# EAGLE schematic step400_r1 (EAGLE 9.6.2)

## Sheet 1 of 3
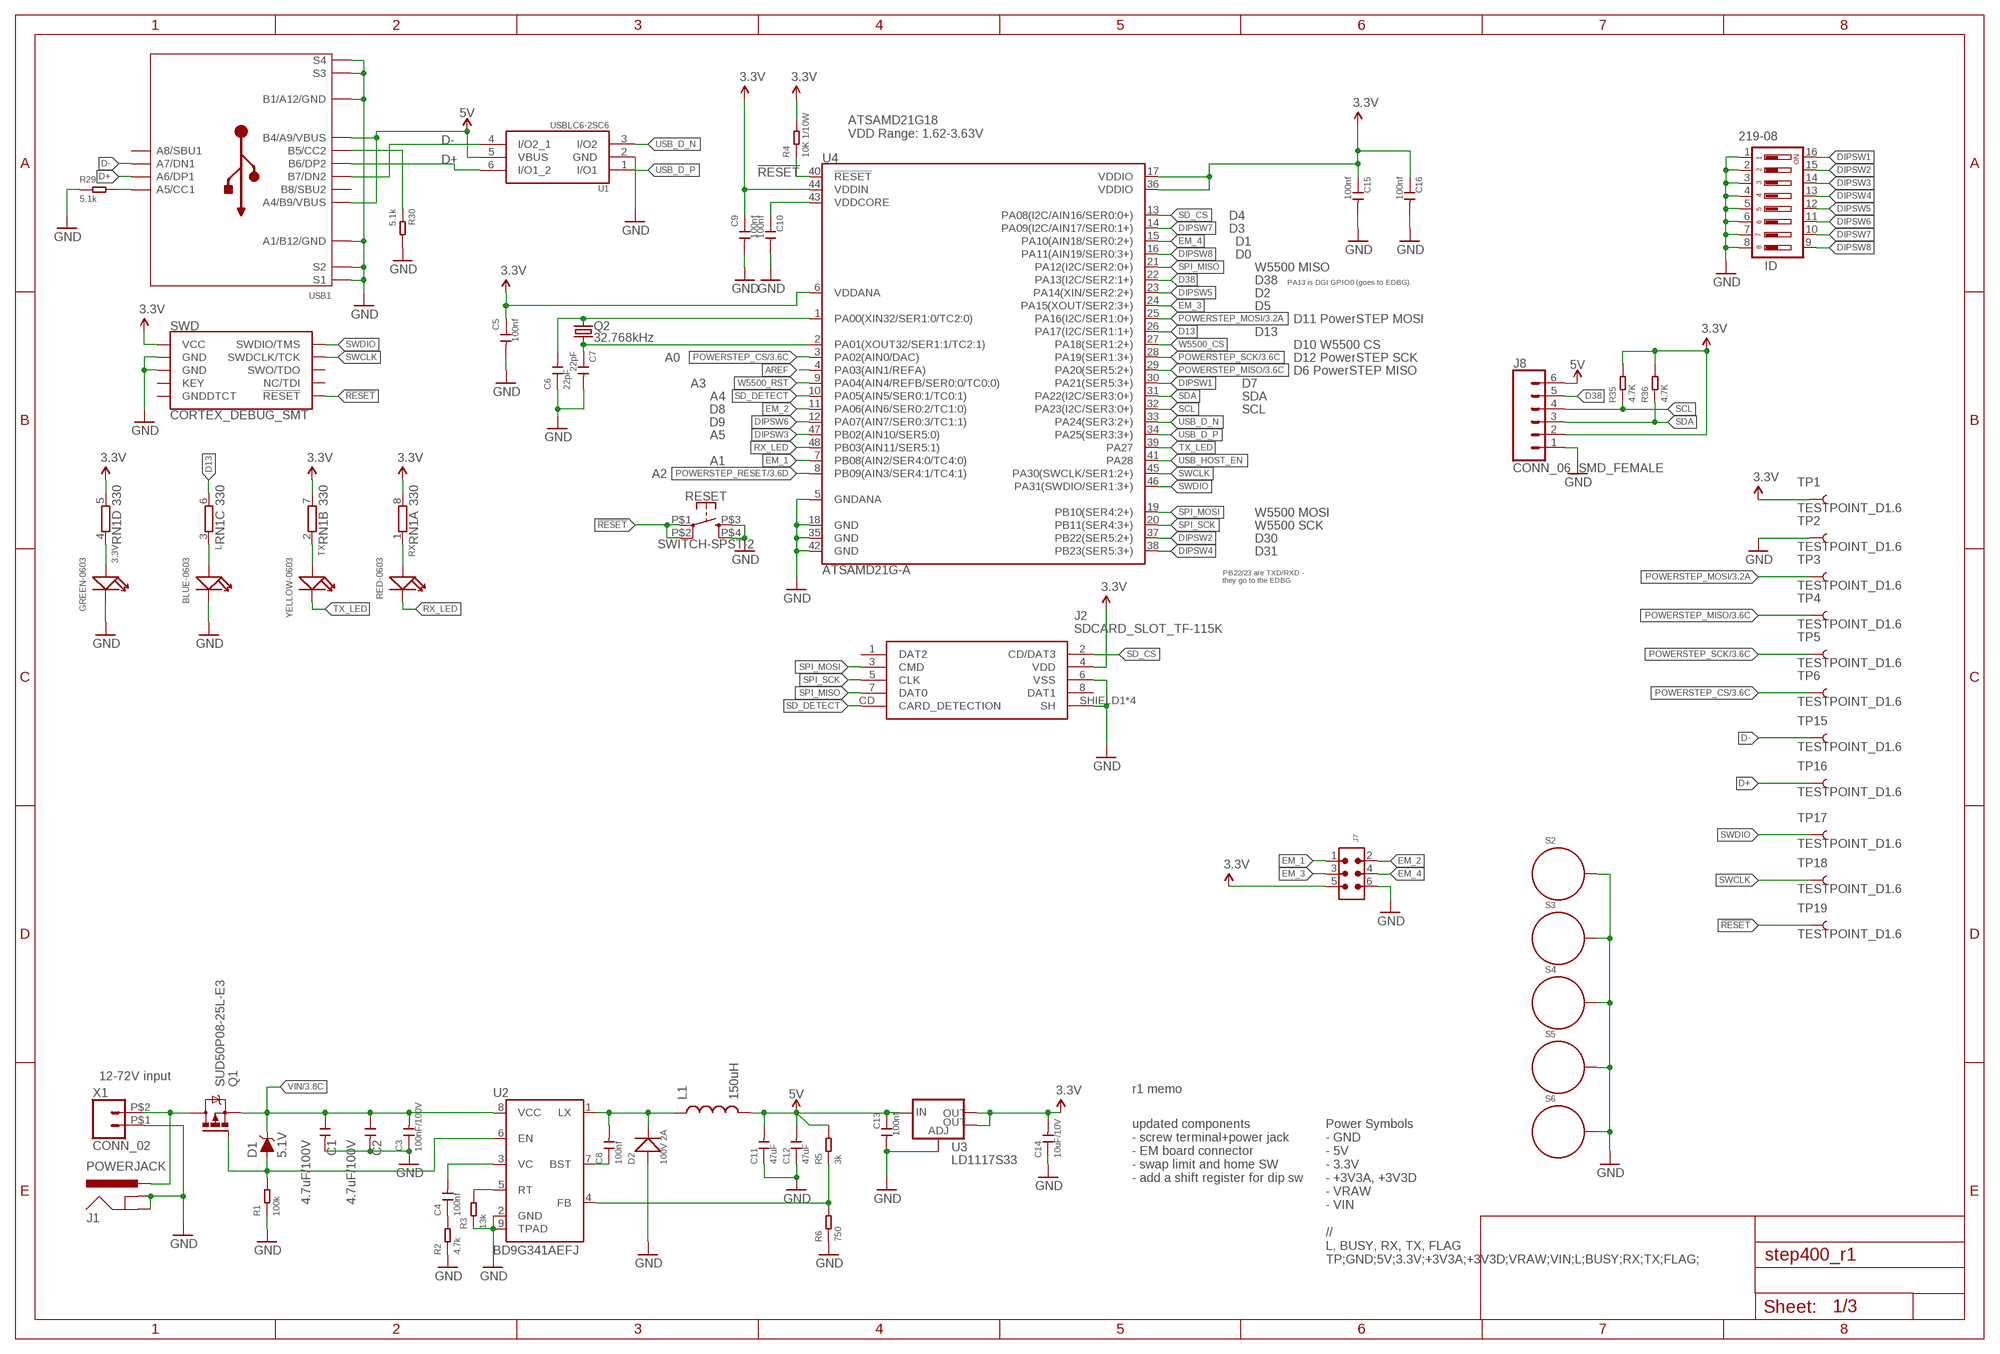
[diagram p0: schematic, sheet 1]

### Parts
3.3V  GREEN-0603  SMD-LED-CLEAR-GREEN(0603)  [LED-0603]
C1  4.7uF/100V  CERAMIC-10UF-16V-(-20%～+80%)-Y5V(1210)  [C1210]
C2  4.7uF/100V  CERAMIC-10UF-16V-(-20%～+80%)-Y5V(1210)  [C1210]
C3  100nF/100V  CERAMIC-100NF-50V-10%-X7R(0805)  [C0805]
C4  100nf  CERAMIC-100NF-50V-10%-X7R(0603)  [C0603]
C5  100nf  CERAMIC-100NF-25V-10%-X7R(0402)  [C0402]
C6  22pF  CERAMIC-15PF-50V-5%-NPO(0402)  [C0402]
C7  22pF  CERAMIC-15PF-50V-5%-NPO(0402)  [C0402]
C8  100nf  CERAMIC-100NF-50V-10%-X7R(0603)  [C0603]
C9  100nf  CERAMIC-100NF-25V-10%-X7R(0402)  [C0402]
C10  100nf  CERAMIC-100NF-25V-10%-X7R(0402)  [C0402]
C11  47uF  CERAMIC-100UF-6.3V-20%-X5R(1206)  [C1206]
C12  47uF  CERAMIC-100UF-6.3V-20%-X5R(1206)  [C1206]
C13  100nf  CERAMIC-100NF-25V-10%-X7R(0402)  [C0402]
C14  10uF/10V  CERAMIC-10UF-10V-(-20%～+80%)-Y5V(0805)  [C0805]
C15  100nf  CERAMIC-100NF-25V-10%-X7R(0402)  [C0402]
C16  100nf  CERAMIC-100NF-25V-10%-X7R(0402)  [C0402]
D1  5.1V  DIODE-ZENER-MM3Z3V3T1G  [SOD-323]
D2  100V 2A  SMD-DIODE-SCHOTTKY-40V-1A(DO-214AC)  [DO-214AC]
ID  219-08  [CTS-219-08]
J1  POWERJACK  [POWERJACK_SLOT]
J2  SDCARD_SLOT_TF-115K  [TF-115K]
J7  6120XX21621_61200621621  [61200621621]
J8  CONN_06_SMD_FEMALE  [1X06-SMD-FEMALE]
L  BLUE-0603  SMD-LED-CLEAR-BLUE(0603)  [LED-0603]
L1  150uH  L5045  [L5045_L]
Q1  SUD50P08-25L-E3  IRFR5305  [D-PAK_TO252AA]
Q2  32.768kHz  CRYSTALFC-135  [FC-135]
R1  100k  SMD-RES-100K-1%-1/10W(0603)  [R0603]
R2  4.7k  SMD-RES-100K-1%-1/10W(0603)  [R0603]
R3  13k  SMD-RES-100K-1%-1/10W(0603)  [R0603]
R4  10K 1/10W  SMD-RES-10K-5%-1/10W(0603)  [R0603]
R5  3k  SMD-RES-100K-1%-1/10W(0603)  [R0603]
R6  750  SMD-RES-100K-1%-1/10W(0603)  [R0603]
R29  5.1k  SMD-RES-5.1K-1%-1/10W(0603)  [R0603]
R30  5.1k  SMD-RES-5.1K-1%-1/10W(0603)  [R0603]
R35  4.7K  SMD-RES-4.7K-5%-1/10W(0603)  [R0603]
R36  4.7K  SMD-RES-4.7K-5%-1/10W(0603)  [R0603]
RESET  SWITCH-SPST-2  [SKRP]
RN1  330  4R-NCAY16_LONG_W  [CAY16_LONG_W]
RX  RED-0603  LED-SMD-RED-DIFFUSED(0603)  [LED-0603]
S2  STANDOFF_ELECTRICAL  [STANDOFF-ELECTRICAL]
S3  STANDOFF_ELECTRICAL  [STANDOFF-ELECTRICAL]
S4  STANDOFF_ELECTRICAL  [STANDOFF-ELECTRICAL]
S5  STANDOFF_ELECTRICAL  [STANDOFF-ELECTRICAL]
S6  STANDOFF_ELECTRICAL  [STANDOFF-ELECTRICAL]
SWD  CORTEX_DEBUG_SMT  [20021121-00010C4LF]
TP1  TESTPOINT_D1.6  [TESTPOINT_D1.6]
TP2  TESTPOINT_D1.6  [TESTPOINT_D1.6]
TP3  TESTPOINT_D1.6  [TESTPOINT_D1.6]
TP4  TESTPOINT_D1.6  [TESTPOINT_D1.6]
TP5  TESTPOINT_D1.6  [TESTPOINT_D1.6]
TP6  TESTPOINT_D1.6  [TESTPOINT_D1.6]
TP15  TESTPOINT_D1.6  [TESTPOINT_D1.6]
TP16  TESTPOINT_D1.6  [TESTPOINT_D1.6]
TP17  TESTPOINT_D1.6  [TESTPOINT_D1.6]
TP18  TESTPOINT_D1.6  [TESTPOINT_D1.6]
TP19  TESTPOINT_D1.6  [TESTPOINT_D1.6]
TX  YELLOW-0603  SMD-LED-CLEAR-YELLOW(0603)  [LED-0603]
U1  USBLC6-2SC6  [SOT23-6L]
U2  BD9G341AEFJ  [SOIC127P600X100-9N]
U3  LD1117S33  V_REG_LM1117SOT223  [SOT223]
U4  ATSAMD21G-A  [TQFP-48]
USB1  USB-C_USB2.0-TYPE-C  [USB-C_USB2.0-TYPE-C]
X1  CONN_02  [WJ25C-B-7.62-2P]

### Nets
3.3V [GND_]: C5.1 C9.1 C14.2 C15.1 C16.1 J2.4(VDD) J7.5 J8.2 R4.2 R35.2 R36.2 RN1.5 RN1.7 RN1.8 SWD.P$1(VCC) TP1.1 U3.2(OUT) U3.4(OUT) U4.6(VDDANA) U4.17(VDDIO) U4.36(VDDIO) U4.44(VDDIN) ; also sheet 2,3
5V: C11.2 C12.2 C13.1 J8.6 L1.P$2 R5.2 U1.5(VBUS) U3.3(IN) USB1.A4_B9(A4/B9/VBUS) USB1.B4_A9(B4/A9/VBUS) ; also sheet 3
!RESET: R4.1 RESET.P$1 RESET.P$2 SWD.P$10(!RESET) TP19.1 U4.40(!RESET!)
AREF: U4.4(PA03(AIN1/REFA))
D13: RN1.6 U4.26(PA17(I2C/SER1:1+))
D38: J8.5 U4.22(PA13(I2C/SER2:1+))
D+: TP16.1 U1.6(I/O1_2) USB1.A6(A6/DP1) USB1.B6(B6/DP2)
D-: TP15.1 U1.4(I/O2_1) USB1.A7(A7/DN1) USB1.B7(B7/DN2)
DIPSW1: ID.16 U4.30(PA21(SER5:3+))
DIPSW2: ID.15 U4.37(PB22(SER5:2+))
DIPSW3: ID.14 U4.47(PB02(AIN10/SER5:0))
DIPSW4: ID.13 U4.38(PB23(SER5:3+))
DIPSW5: ID.12 U4.23(PA14(XIN/SER2:2+))
DIPSW6: ID.11 U4.12(PA07(AIN7/SER0:3/TC1:1))
DIPSW7: ID.10 U4.14(PA09(I2C/AIN17/SER0:1+))
DIPSW8: ID.9 U4.16(PA11(AIN19/SER0:3+))
EM_1: J7.1 U4.7(PB08(AIN2/SER4:0/TC4:0))
EM_2: J7.2 U4.11(PA06(AIN6/SER0:2/TC1:0))
EM_3: J7.3 U4.24(PA15(XOUT/SER2:3+))
EM_4: J7.4 U4.15(PA10(AIN18/SER0:2+))
GND: 3.3V.- C1.2 C2.2 C3.1 C5.2 C6.1 C7.2 C9.2 C10.2 C11.1 C12.1 C13.2 C14.1 C15.2 C16.2 D2.1(+) ID.1 ID.2 ID.3 ID.4 ID.5 ID.6 ID.7 ID.8 J1.P$33(GNDBREAK) J1.P$34(GNDBREAK) J1.P$35(GNDBREAK) J1.P$36(GNDBREAK) J1.P$37(GNDBREAK) J1.P$38(GNDBREAK) J1.P$39(GNDBREAK) J1.P$40(GNDBREAK) J1.P$41(GNDBREAK) J1.P$42(GNDBREAK) J1.P$43(GNDBREAK) J1.P$44(GNDBREAK) J1.P$45(GNDBREAK) J1.P$46(GNDBREAK) J1.P$47(GNDBREAK) J1.P$48(GNDBREAK) J1.P$49(GNDBREAK) J1.P$50(GNDBREAK) J1.P$51(GNDBREAK) J1.P$52(GNDBREAK) J1.P$53(GNDBREAK) J1.P$54(GNDBREAK) J1.P$55(GNDBREAK) J1.P$56(GNDBREAK) J1.P$63(GND) J1.P$64(GND) J1.P$65(GND) J1.P$66(GND) J1.P$67(GND) J1.P$68(GND) J1.P$69(GND) J1.P$70(GND) J1.P$71(GND) J1.P$72(GND) J1.P$73(GND) J1.P$74(GND) J1.P$75(GND) J1.P$76(GND) J1.P$77(GND) J1.P$78(GND) J1.P$79(GND) J1.P$80(GND) J1.P$81(GND) J1.P$82(GND) J1.P$83(GND) J1.P$84(GND) J1.P$85(GND) J2.6(VSS) J2.SHIELD1(SH) J2.SHIELD2(SH) J2.SHIELD3(SH) J2.SHIELD4(SH) J7.6 J8.1 L.- R1.1 R2.1 R3.1 R6.1 R29.1 R30.2 RESET.P$3 RESET.P$4 S2.P1 S3.P1 S4.P1 S5.P1 S6.P1 SWD.P$3(GND) SWD.P$5(GND) TP2.1 U1.2(GND) U2.2(GND) U2.9(TPAD) U3.1(ADJ) U4.5(GNDANA) U4.18(GND) U4.35(GND) U4.42(GND) USB1.A1_B12(A1/B12/GND) USB1.B1_A12(B1/A12/GND) USB1.S7(S1) USB1.S8(S1) USB1.S9(S1) USB1.S10(S1) USB1.S11(S1) USB1.S12(S1) USB1.S13(S1) USB1.S14(S1) USB1.S15(S1) USB1.S16(S3) USB1.S17(S3) USB1.S18(S3) USB1.S19(S3) USB1.S20(S3) USB1.S21(S3) USB1.S22(S3) USB1.S23(S3) USB1.S24(S3) USB1.S25(S3) USB1.S26(S3) USB1.S27(S3) USB1.S29(S2) USB1.S30(S2) USB1.S31(S2) USB1.S32(S2) USB1.S33(S2) USB1.S34(S2) USB1.S35(S2) USB1.S36(S2) USB1.S37(S4) USB1.S38(S4) USB1.S39(S4) USB1.S40(S4) USB1.S41(S4) USB1.S42(S4) USB1.S43(S4) USB1.S44(S4) USB1.S45(S4) USB1.S46(S4) USB1.S47(S4) USB1.S48(S4) X1.P$1 ; also sheet 2,3
N$2: C6.2 Q2.P$2 U4.1(PA00(XIN32/SER1:0/TC2:0))
N$3: C4.1 R2.2
N$4: C7.1 Q2.P$1 U4.2(PA01(XOUT32/SER1:1/TC2:1))
N$5: RN1.1 RX.+
N$6: RN1.2 TX.+
N$7: R5.1 R6.2 U2.4(FB)
N$8: D1.A Q1.1(G) R1.2 U2.6(EN)
N$9: R3.2 U2.5(RT)
N$10: L.+ RN1.3
N$11: 3.3V.+ RN1.4
N$12: C4.2 U2.3(VC)
N$15: C8.1 U2.7(BST)
N$17: C8.2 D2.2(-) L1.P$1 U2.1(LX)
N$45: R30.1 USB1.B5(B5/CC2)
N$50: R29.2 USB1.A5(A5/CC1)
POWERSTEP_CS: TP6.1 U4.3(PA02(AIN0/DAC)) ; also sheet 3
POWERSTEP_MISO: TP4.1 U4.29(PA20(SER5:2+)) ; also sheet 3
POWERSTEP_MOSI: TP3.1 U4.25(PA16(I2C/SER1:0+)) ; also sheet 3
POWERSTEP_RESET: U4.8(PB09(AIN3/SER4:1/TC4:1)) ; also sheet 3
POWERSTEP_SCK: TP5.1 U4.28(PA19(SER1:3+)) ; also sheet 3
RX_LED: RX.- U4.48(PB03(AIN11/SER5:1))
SCL: J8.4 R35.1 U4.32(PA23(I2C/SER3:0+))
SD_CS: J2.2(CD/DAT3) U4.13(PA08(I2C/AIN16/SER0:0+))
SD_DETECT: J2.CD(CARD_DETECTION) U4.10(PA05(AIN5/SER0:1/TC0:1))
SDA: J8.3 R36.1 U4.31(PA22(I2C/SER3:0+))
SPI_MISO: J2.7(DAT0) U4.21(PA12(I2C/SER2:0+)) ; also sheet 2
SPI_MOSI: J2.3(CMD) U4.19(PB10(SER4:2+)) ; also sheet 2
SPI_SCK: J2.5(CLK) U4.20(PB11(SER4:3+)) ; also sheet 2
SWCLK: SWD.P$4(SWDCLK/TCK) TP18.1 U4.45(PA30(SWCLK/SER1:2+))
SWDIO: SWD.P$2(SWDIO/TMS) TP17.1 U4.46(PA31(SWDIO/SER1:3+))
TX_LED: TX.- U4.39(PA27)
USB_D_N: U1.3(I/O2) U4.33(PA24(SER3:2+))
USB_D_P: U1.1(I/O1) U4.34(PA25(SER3:3+))
USB_HOST_EN: U4.41(PA28)
VDDCORE: C10.1 U4.43(VDDCORE)
VIN: C1.1 C2.1 C3.2 D1.C Q1.3(S) U2.8(VCC) ; also sheet 3
VRAW: J1.P$2(PWR) J1.P$3(PWR) J1.P$4(PWR) J1.P$5(PWR) J1.P$6(PWR) J1.P$7(PWR) J1.P$8(PWR) J1.P$9(PWR) J1.P$10(PWR) J1.P$11(PWR) J1.P$12(PWR) J1.P$13(PWR) J1.P$14(PWR) J1.P$15(PWR) J1.P$16(PWR) J1.P$17(PWR) J1.P$18(PWR) J1.P$19(PWR) J1.P$20(PWR) J1.P$21(PWR) J1.P$22(PWR) J1.P$23(PWR) J1.P$24(PWR) J1.P$25(PWR) J1.P$26(PWR) J1.P$27(PWR) J1.P$28(PWR) Q1.4(D) X1.P$2
W5500_CS: U4.27(PA18(SER1:2+)) ; also sheet 2
W5500_RST: U4.9(PA04(AIN4/REFB/SER0:0/TC0:0)) ; also sheet 2
Unconnected: J2.1(DAT2) J2.8(DAT1) SWD.P$6(SWO/TDO) SWD.P$7(KEY) SWD.P$8(NC/TDI) SWD.P$9(GNDDTCT) USB1.A8(A8/SBU1) USB1.B8(B8/SBU2)

### Notes on the sheet
- ATSAMD21G18
  VDD Range: 1.62-3.63V
- D4
- D3
- D1
- D0
- W5500 MISO
- D38 | PA13 is DGI GPIO0 (goes to EDBG).
- D2
- D5
- D11 PowerSTEP MOSI
- D13
- D10 W5500 CS
- A0 | D12 PowerSTEP SCK
- D6 PowerSTEP MISO
- A3 | D7
- A4 | SDA
- D8 | SCL
- D9
- A5
- A1
- A2
- W5500 MOSI
- W5500 SCK
- D30
- D31
- PB22/23 are TXD/RXD - 
  they go to the EDBG
- 12-72V input
- r1 memo
- updated components
  - screw terminal+power jack
  - EM board connector
  - swap limit and home SW
  - add a shift register for dip sw
- Power Symbols
  - GND
  - 5V
  - 3.3V
  - +3V3A, +3V3D
  - VRAW
  - VIN
  
  //
  L, BUSY, RX, TX, FLAG
  TP;GND;5V;3.3V;+3V3A;+3V3D;VRAW;VIN;L;BUSY;RX;TX;FLAG;

## Sheet 2 of 3
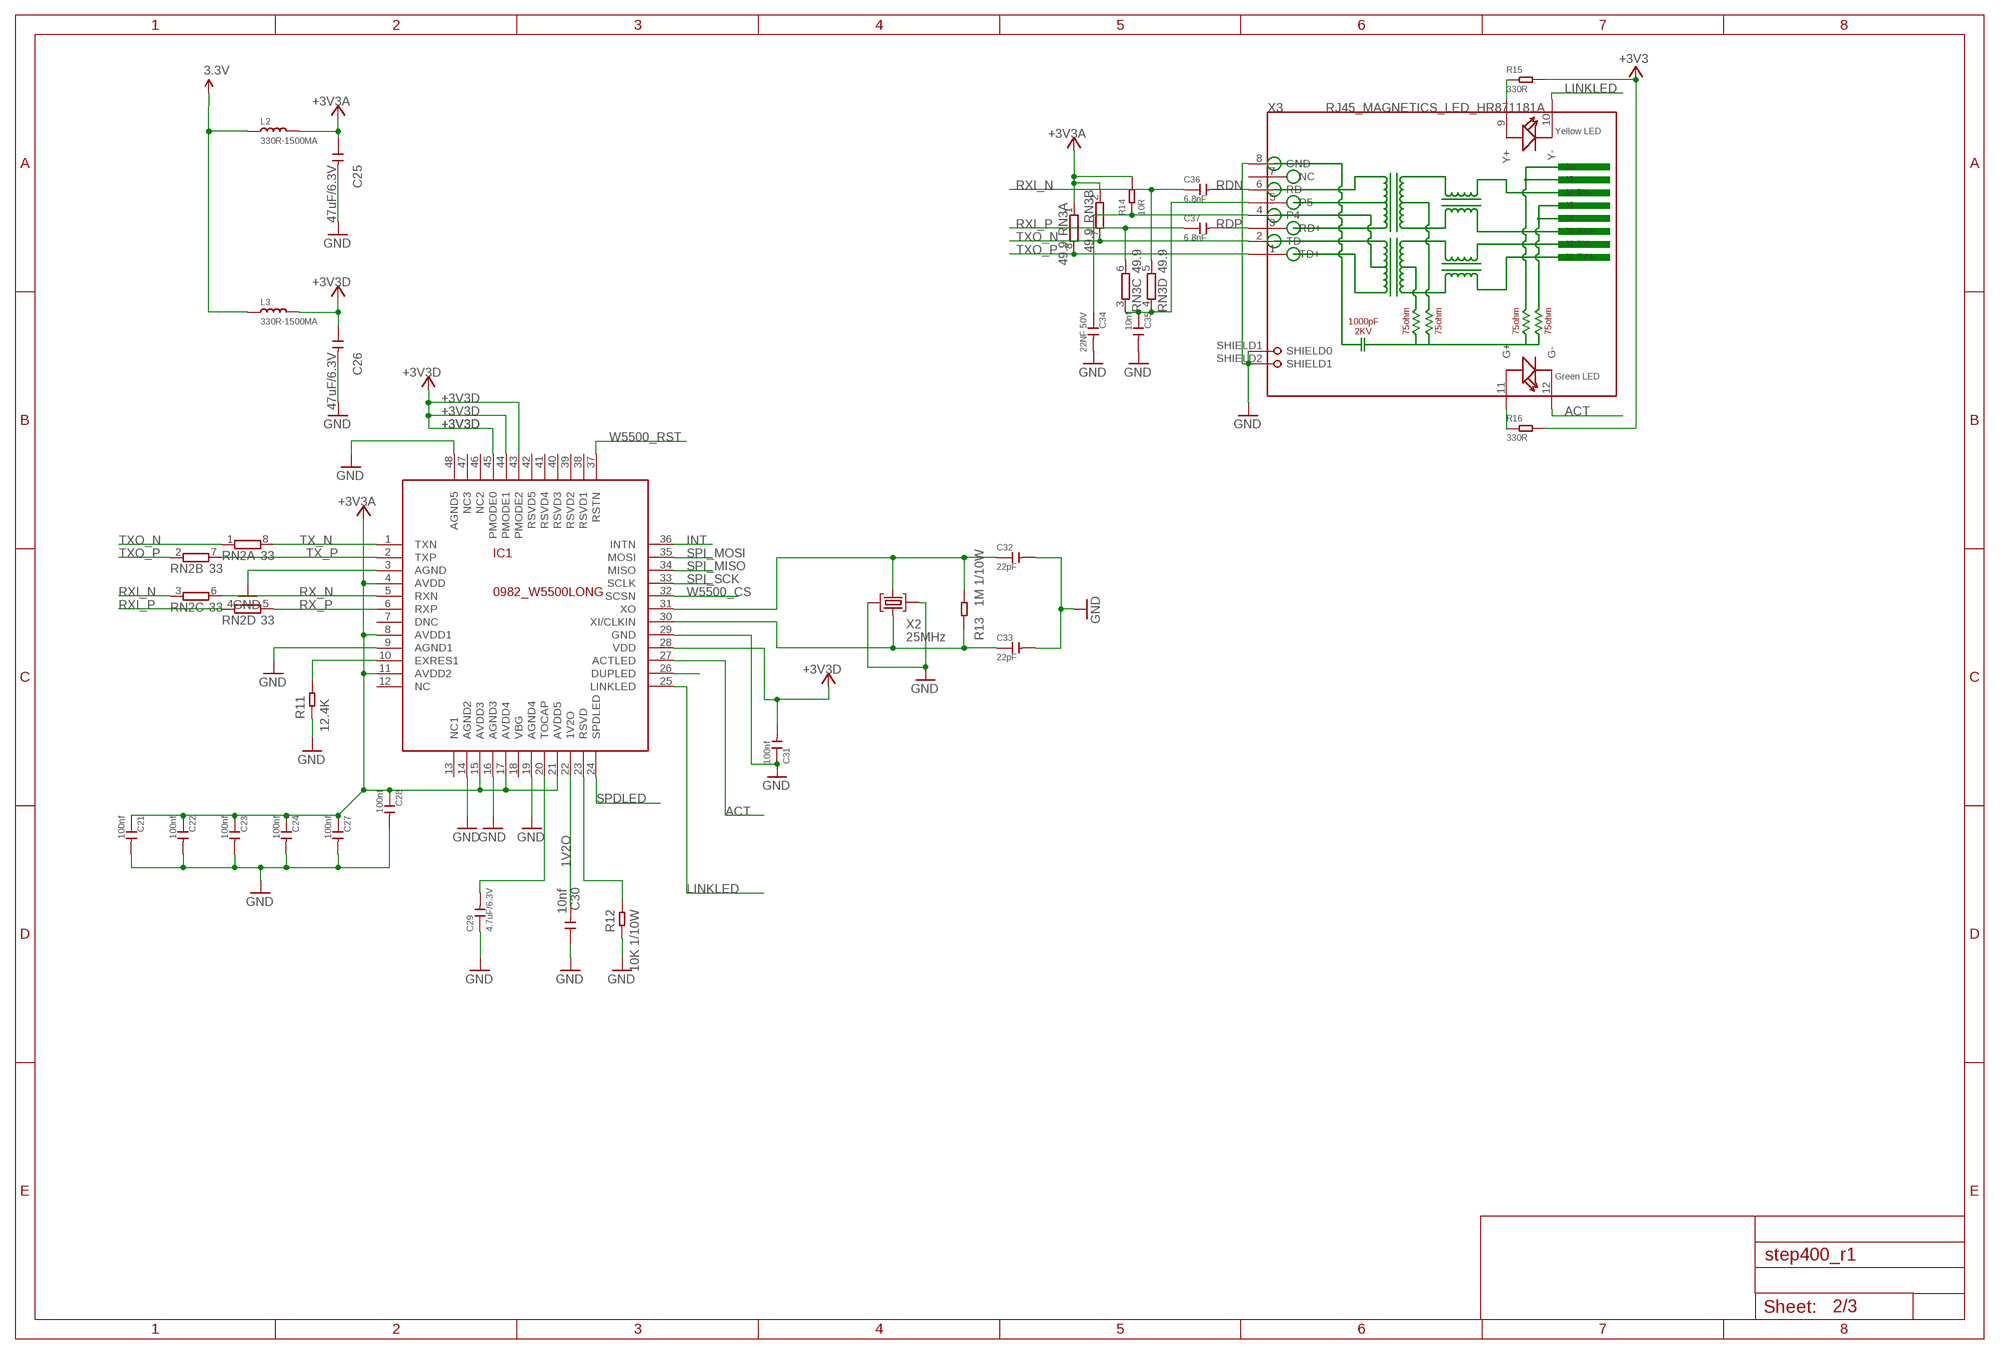
[diagram p1: schematic, sheet 2]

### Parts
C21  100nf  CERAMIC-100NF-25V-10%-X7R(0402)  [C0402]
C22  100nf  CERAMIC-100NF-25V-10%-X7R(0402)  [C0402]
C23  100nf  CERAMIC-100NF-25V-10%-X7R(0402)  [C0402]
C24  100nf  CERAMIC-100NF-25V-10%-X7R(0402)  [C0402]
C25  47uF/6.3V  CERAMIC-100UF-6.3V-20%-X5R(1206)  [C1206]
C26  47uF/6.3V  CERAMIC-100UF-6.3V-20%-X5R(1206)  [C1206]
C27  100nf  CERAMIC-100NF-25V-10%-X7R(0402)  [C0402]
C28  100nf  CERAMIC-100NF-25V-10%-X7R(0402)  [C0402]
C29  4.7uF/6.3V  CERAMIC-4.7UF-10V-10%-X5R(0603)  [C0603]
C30  10nf  CERAMIC-10NF-50V-10%-X7R(0402)  [C0402]
C31  100nf  CERAMIC-100NF-25V-10%-X7R(0402)  [C0402]
C32  22pF  CERAMIC-15PF-50V-5%-NPO(0402)  [C0402]
C33  22pF  CERAMIC-15PF-50V-5%-NPO(0402)  [C0402]
C34  22NF 50V  CERAMIC-22NF-50V-10%-X7R(0402)  [C0402]
C35  10nf  CERAMIC-10NF-50V-10%-X7R(0402)  [C0402]
C36  6.8nF  CERAMIC-4.7NF-50V-10%-X7R(0402)  [C0402]
C37  6.8nF  CERAMIC-4.7NF-50V-10%-X7R(0402)  [C0402]
IC1  0982_W5500LONG  [TQFP48-LONG]
L2  330R-1500MA  SMD-FERRITE-BEAD-330R-1500MA(0805)'0805'  [L0805]
L3  330R-1500MA  SMD-FERRITE-BEAD-330R-1500MA(0805)'0805'  [L0805]
R11  12.4K  SMD-RES-12K-1%-1/10W(0603)  [R0603]
R12  10K 1/10W  SMD-RES-10K-5%-1/10W(0603)  [R0603]
R13  1M 1/10W  SMD-RES-1M-5%-1/10W(0603)  [R0603]
R14  10R  SMD-RES-10R-5%-1/10W(0603)  [R0603]
R15  330R  SMD-RES-330R-1%-1/10W(0603)  [R0603]
R16  330R  SMD-RES-330R-1%-1/10W(0603)  [R0603]
RN2  33  4R-NCAY16_LONG_W  [CAY16_LONG_W]
RN3  49.9  4R-NCAY16_LONG_W  [CAY16_LONG_W]
X2  25MHz  CRYSTAL-3.2-2.5  [CRYSTAL-3.2-2.5]
X3  RJ45_MAGNETICS_LED_HR871181A  [HR871181A]

### Nets
1V2O: C30.2 IC1.22(1V2O)
3.3V [GND_]: L2.1 L3.1 R15.2 R16.2 ; supply symbol labelled +3V3 ; also sheet 1,3
+3V3A [POWER_]: C21.1 C22.1 C23.1 C24.1 C25.1 C27.1 C28.1 IC1.4(AVDD) IC1.8(AVDD1) IC1.11(AVDD2) IC1.15(AVDD3) IC1.17(AVDD4) IC1.21(AVDD5) L2.2 R14.2 RN3.1 RN3.2
+3V3D: C26.1 C31.2 IC1.28(VDD) IC1.43(PMODE2) IC1.44(PMODE1) IC1.45(PMODE0) L3.2
ACT: IC1.27(ACTLED) X3.12(G-)
FDXLED: IC1.26(DUPLED)
GND: C21.2 C22.2 C23.2 C24.2 C25.2 C26.2 C27.2 C28.2 C29.1 C30.1 C31.1 C32.2 C33.2 C34.2 C35.2 IC1.3(AGND) IC1.9(AGND1) IC1.14(AGND2) IC1.16(AGND3) IC1.19(AGND4) IC1.29(GND) IC1.48(AGND5) R11.1 R12.1 X2.2(GND) X2.4(GND) X3.8(GND) X3.SHIELD1(SHIELD0) X3.SHIELD2(SHIELD1) ; also sheet 1,3
INT: IC1.36(INTN)
LINKLED: IC1.25(LINKLED) X3.10(Y-)
N$13: C32.1 IC1.31(XO) R13.1 X2.3(C2)
N$19: C34.1 R14.1 X3.4
N$21: C35.1 RN3.3 RN3.4 X3.5
N$22: R15.1 X3.9(Y+)
N$23: R16.1 X3.11(G+)
N$24: IC1.23(RSVD) R12.2
N$38: C29.2 IC1.20(TOCAP)
N$40: IC1.10(EXRES1) R11.2
OSC2E2: C33.1 IC1.30(XI/CLKIN) R13.2 X2.1(C1)
RDN: C36.2 X3.6(RD-)
RDP: C37.2 X3.3(RD+)
RX_N: IC1.5(RXN) RN2.6
RX_P: IC1.6(RXP) RN2.5
RXI_N: C36.1 RN2.3 RN3.5
RXI_P: C37.1 RN2.4 RN3.6
SPDLED: IC1.24(SPDLED)
SPI_MISO: IC1.34(MISO) ; also sheet 1
SPI_MOSI: IC1.35(MOSI) ; also sheet 1
SPI_SCK: IC1.33(SCLK) ; also sheet 1
TX_N: IC1.1(TXN) RN2.8
TX_P: IC1.2(TXP) RN2.7
TXO_N: RN2.1 RN3.7 X3.2(TD-)
TXO_P: RN2.2 RN3.8 X3.1(TD+)
W5500_CS: IC1.32(SCSN) ; also sheet 1
W5500_RST: IC1.37(RSTN) ; also sheet 1
Unconnected: IC1.7(DNC) IC1.13(NC1) IC1.18(VBG) IC1.41(RSVD4) IC1.42(RSVD5) IC1.46(NC2) IC1.47(NC3) X3.7(NC)

## Sheet 3 of 3
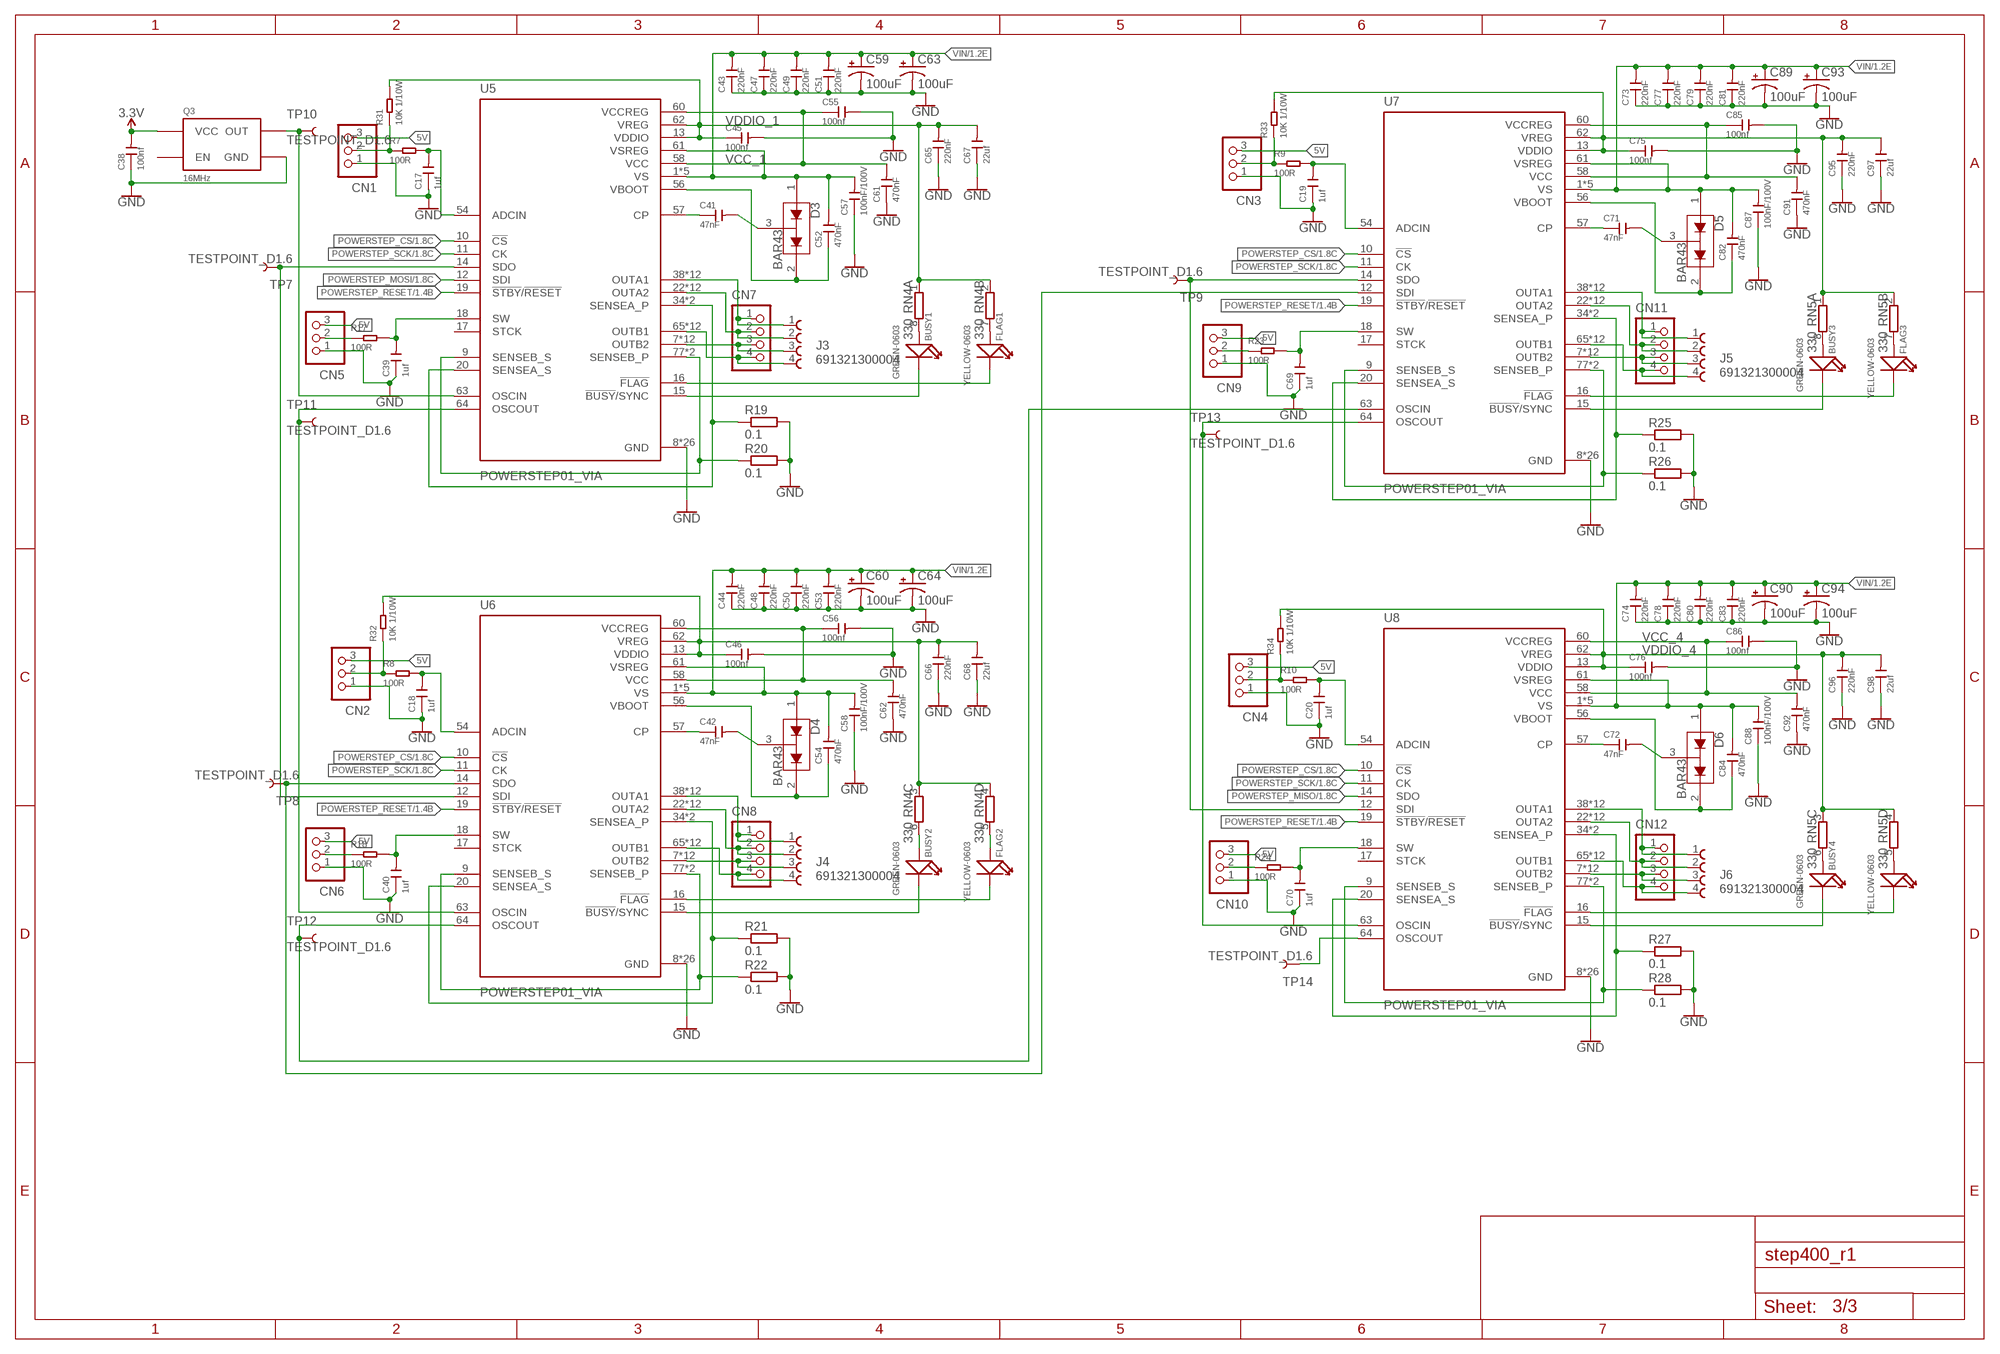
[diagram p2: schematic, sheet 3]

### Parts
BUSY1  GREEN-0603  SMD-LED-CLEAR-GREEN(0603)  [LED-0603]
BUSY2  GREEN-0603  SMD-LED-CLEAR-GREEN(0603)  [LED-0603]
BUSY3  GREEN-0603  SMD-LED-CLEAR-GREEN(0603)  [LED-0603]
BUSY4  GREEN-0603  SMD-LED-CLEAR-GREEN(0603)  [LED-0603]
C17  1uf  CERAMIC-1UF-25V-10%-X7R(0603)  [C0603]
C18  1uf  CERAMIC-1UF-25V-10%-X7R(0603)  [C0603]
C19  1uf  CERAMIC-1UF-25V-10%-X7R(0603)  [C0603]
C20  1uf  CERAMIC-1UF-25V-10%-X7R(0603)  [C0603]
C38  100nf  CERAMIC-100NF-25V-10%-X7R(0402)  [C0402]
C39  1uf  CERAMIC-1UF-25V-10%-X7R(0603)  [C0603]
C40  1uf  CERAMIC-1UF-25V-10%-X7R(0603)  [C0603]
C41  47nF  CERAMIC-100NF-50V-10%-X7R(0805)  [C0805]
C42  47nF  CERAMIC-100NF-50V-10%-X7R(0805)  [C0805]
C43  220nF  CERAMIC-22UF-6.3V-20%-X5R(0805)  [C0805]
C44  220nF  CERAMIC-22UF-6.3V-20%-X5R(0805)  [C0805]
C45  100nf  CERAMIC-100NF-25V-10%-X7R(0402)  [C0402]
C46  100nf  CERAMIC-100NF-25V-10%-X7R(0402)  [C0402]
C47  220nF  CERAMIC-22UF-6.3V-20%-X5R(0805)  [C0805]
C48  220nF  CERAMIC-22UF-6.3V-20%-X5R(0805)  [C0805]
C49  220nF  CERAMIC-22UF-6.3V-20%-X5R(0805)  [C0805]
C50  220nF  CERAMIC-22UF-6.3V-20%-X5R(0805)  [C0805]
C51  220nF  CERAMIC-22UF-6.3V-20%-X5R(0805)  [C0805]
C52  470nF  CERAMIC-100PF-50V-5%-NPO(0603)  [C0603]
C53  220nF  CERAMIC-22UF-6.3V-20%-X5R(0805)  [C0805]
C54  470nF  CERAMIC-100PF-50V-5%-NPO(0603)  [C0603]
C55  100nf  CERAMIC-100NF-25V-10%-X7R(0402)  [C0402]
C56  100nf  CERAMIC-100NF-25V-10%-X7R(0402)  [C0402]
C57  100nF/100V  CERAMIC-100NF-50V-10%-X7R(0805)  [C0805]
C58  100nF/100V  CERAMIC-100NF-50V-10%-X7R(0805)  [C0805]
C59  100uF  CPOL-USE5-10.5  [E5-10,5]
C60  100uF  CPOL-USE5-10.5  [E5-10,5]
C61  470nF  CERAMIC-220NF-25V-10%-X7R(0603)  [C0603]
C62  470nF  CERAMIC-220NF-25V-10%-X7R(0603)  [C0603]
C63  100uF  CPOL-USE5-10.5  [E5-10,5]
C64  100uF  CPOL-USE5-10.5  [E5-10,5]
C65  220nF  CERAMIC 100NF-10V-10%-X5R(0402)  [C0402]
C66  220nF  CERAMIC 100NF-10V-10%-X5R(0402)  [C0402]
C67  22uf  CERAMIC-22UF-6.3V-20%-X5R(0805)  [C0805]
C68  22uf  CERAMIC-22UF-6.3V-20%-X5R(0805)  [C0805]
C69  1uf  CERAMIC-1UF-25V-10%-X7R(0603)  [C0603]
C70  1uf  CERAMIC-1UF-25V-10%-X7R(0603)  [C0603]
C71  47nF  CERAMIC-100NF-50V-10%-X7R(0805)  [C0805]
C72  47nF  CERAMIC-100NF-50V-10%-X7R(0805)  [C0805]
C73  220nF  CERAMIC-22UF-6.3V-20%-X5R(0805)  [C0805]
C74  220nF  CERAMIC-22UF-6.3V-20%-X5R(0805)  [C0805]
C75  100nf  CERAMIC-100NF-25V-10%-X7R(0402)  [C0402]
C76  100nf  CERAMIC-100NF-25V-10%-X7R(0402)  [C0402]
C77  220nF  CERAMIC-22UF-6.3V-20%-X5R(0805)  [C0805]
C78  220nF  CERAMIC-22UF-6.3V-20%-X5R(0805)  [C0805]
C79  220nF  CERAMIC-22UF-6.3V-20%-X5R(0805)  [C0805]
C80  220nF  CERAMIC-22UF-6.3V-20%-X5R(0805)  [C0805]
C81  220nF  CERAMIC-22UF-6.3V-20%-X5R(0805)  [C0805]
C82  470nF  CERAMIC-100PF-50V-5%-NPO(0603)  [C0603]
C83  220nF  CERAMIC-22UF-6.3V-20%-X5R(0805)  [C0805]
C84  470nF  CERAMIC-100PF-50V-5%-NPO(0603)  [C0603]
C85  100nf  CERAMIC-100NF-25V-10%-X7R(0402)  [C0402]
C86  100nf  CERAMIC-100NF-25V-10%-X7R(0402)  [C0402]
C87  100nF/100V  CERAMIC-100NF-50V-10%-X7R(0805)  [C0805]
C88  100nF/100V  CERAMIC-100NF-50V-10%-X7R(0805)  [C0805]
C89  100uF  CPOL-USE5-10.5  [E5-10,5]
C90  100uF  CPOL-USE5-10.5  [E5-10,5]
C91  470nF  CERAMIC-220NF-25V-10%-X7R(0603)  [C0603]
C92  470nF  CERAMIC-220NF-25V-10%-X7R(0603)  [C0603]
C93  100uF  CPOL-USE5-10.5  [E5-10,5]
C94  100uF  CPOL-USE5-10.5  [E5-10,5]
C95  220nF  CERAMIC 100NF-10V-10%-X5R(0402)  [C0402]
C96  220nF  CERAMIC 100NF-10V-10%-X5R(0402)  [C0402]
C97  22uf  CERAMIC-22UF-6.3V-20%-X5R(0805)  [C0805]
C98  22uf  CERAMIC-22UF-6.3V-20%-X5R(0805)  [C0805]
CN1  B3B-XASK-1  [B3B-XASK-1]
CN2  B3B-XASK-1  [B3B-XASK-1]
CN3  B3B-XASK-1  [B3B-XASK-1]
CN4  B3B-XASK-1  [B3B-XASK-1]
CN5  B3B-XASK-1  [B3B-XASK-1]
CN6  B3B-XASK-1  [B3B-XASK-1]
CN7  B4B-XASK-1  [B4B-XASK-1]
CN8  B4B-XASK-1  [B4B-XASK-1]
CN9  B3B-XASK-1  [B3B-XASK-1]
CN10  B3B-XASK-1  [B3B-XASK-1]
CN11  B4B-XASK-1  [B4B-XASK-1]
CN12  B4B-XASK-1  [B4B-XASK-1]
D3  BAR43  BAV99  [SOT23-3]
D4  BAR43  BAV99  [SOT23-3]
D5  BAR43  BAV99  [SOT23-3]
D6  BAR43  BAV99  [SOT23-3]
FLAG1  YELLOW-0603  SMD-LED-CLEAR-YELLOW(0603)  [LED-0603]
FLAG2  YELLOW-0603  SMD-LED-CLEAR-YELLOW(0603)  [LED-0603]
FLAG3  YELLOW-0603  SMD-LED-CLEAR-YELLOW(0603)  [LED-0603]
FLAG4  YELLOW-0603  SMD-LED-CLEAR-YELLOW(0603)  [LED-0603]
J3  691321300004  [691321300004]
J4  691321300004  [691321300004]
J5  691321300004  [691321300004]
J6  691321300004  [691321300004]
Q3  16MHz  CRYSTAL_OSC_SG5032  [SG5032]
R7  100R  SMD-RES-100R-5%-1/10W(0603)  [R0603]
R8  100R  SMD-RES-100R-5%-1/10W(0603)  [R0603]
R9  100R  SMD-RES-100R-5%-1/10W(0603)  [R0603]
R10  100R  SMD-RES-100R-5%-1/10W(0603)  [R0603]
R17  100R  SMD-RES-100R-5%-1/10W(0603)  [R0603]
R18  100R  SMD-RES-100R-5%-1/10W(0603)  [R0603]
R19  0.1  RESISTOR_6332  [RESC6332X71N]
R20  0.1  RESISTOR_6332  [RESC6332X71N]
R21  0.1  RESISTOR_6332  [RESC6332X71N]
R22  0.1  RESISTOR_6332  [RESC6332X71N]
R23  100R  SMD-RES-100R-5%-1/10W(0603)  [R0603]
R24  100R  SMD-RES-100R-5%-1/10W(0603)  [R0603]
R25  0.1  RESISTOR_6332  [RESC6332X71N]
R26  0.1  RESISTOR_6332  [RESC6332X71N]
R27  0.1  RESISTOR_6332  [RESC6332X71N]
R28  0.1  RESISTOR_6332  [RESC6332X71N]
R31  10K 1/10W  SMD-RES-10K-5%-1/10W(0603)  [R0603]
R32  10K 1/10W  SMD-RES-10K-5%-1/10W(0603)  [R0603]
R33  10K 1/10W  SMD-RES-10K-5%-1/10W(0603)  [R0603]
R34  10K 1/10W  SMD-RES-10K-5%-1/10W(0603)  [R0603]
RN4  330  4R-NCAY16_LONG_W  [CAY16_LONG_W]
RN5  330  4R-NCAY16_LONG_W  [CAY16_LONG_W]
TP7  TESTPOINT_D1.6  [TESTPOINT_D1.6]
TP8  TESTPOINT_D1.6  [TESTPOINT_D1.6]
TP9  TESTPOINT_D1.6  [TESTPOINT_D1.6]
TP10  TESTPOINT_D1.6  [TESTPOINT_D1.6]
TP11  TESTPOINT_D1.6  [TESTPOINT_D1.6]
TP12  TESTPOINT_D1.6  [TESTPOINT_D1.6]
TP13  TESTPOINT_D1.6  [TESTPOINT_D1.6]
TP14  TESTPOINT_D1.6  [TESTPOINT_D1.6]
U5  POWERSTEP01_VIA  [IC_POWERSTEP01_VIA]
U6  POWERSTEP01_VIA  [IC_POWERSTEP01_VIA]
U7  POWERSTEP01_VIA  [IC_POWERSTEP01_VIA]
U8  POWERSTEP01_VIA  [IC_POWERSTEP01_VIA]

### Nets
3.3V [GND_]: C38.2 Q3.4(VCC) ; also sheet 1,2
5V: CN1.3 CN2.3 CN3.3 CN4.3 CN5.3 CN6.3 CN9.3 CN10.3 ; also sheet 1
GND: C17.1 C18.1 C19.1 C20.1 C38.1 C39.1 C40.1 C43.1 C44.1 C45.2 C46.2 C47.1 C48.1 C49.1 C50.1 C51.1 C53.1 C55.2 C56.2 C57.1 C58.1 C59.- C60.- C61.1 C62.1 C63.- C64.- C65.1 C66.1 C67.1 C68.1 C69.1 C70.1 C73.1 C74.1 C75.2 C76.2 C77.1 C78.1 C79.1 C80.1 C81.1 C83.1 C85.2 C86.2 C87.1 C88.1 C89.- C90.- C91.1 C92.1 C93.- C94.- C95.1 C96.1 C97.1 C98.1 CN1.1 CN2.1 CN3.1 CN4.1 CN5.1 CN6.1 CN9.1 CN10.1 Q3.2(GND) R19.2 R20.2 R21.2 R22.2 R25.2 R26.2 R27.2 R28.2 U5.8(GND) U5.21(GND) U5.59(GND) U5.EPAD9(GND) U5.EPAD9_VIA1(GND) U5.EPAD9_VIA2(GND) U5.EPAD9_VIA3(GND) U5.EPAD9_VIA4(GND) U5.EPAD9_VIA5(GND) U5.EPAD9_VIA6(GND) U5.EPAD9_VIA7(GND) U5.EPAD9_VIA8(GND) U5.EPAD9_VIA9(GND) U5.EPAD9_VIA10(GND) U5.EPAD9_VIA11(GND) U5.EPAD9_VIA12(GND) U5.EPAD9_VIA13(GND) U5.EPAD9_VIA14(GND) U5.EPAD9_VIA15(GND) U5.EPAD9_VIA16(GND) U5.EPAD9_VIA17(GND) U5.EPAD9_VIA18(GND) U5.EPAD9_VIA19(GND) U5.EPAD9_VIA20(GND) U5.EPAD9_VIA21(GND) U5.EPAD9_VIA22(GND) U6.8(GND) U6.21(GND) U6.59(GND) U6.EPAD9(GND) U6.EPAD9_VIA1(GND) U6.EPAD9_VIA2(GND) U6.EPAD9_VIA3(GND) U6.EPAD9_VIA4(GND) U6.EPAD9_VIA5(GND) U6.EPAD9_VIA6(GND) U6.EPAD9_VIA7(GND) U6.EPAD9_VIA8(GND) U6.EPAD9_VIA9(GND) U6.EPAD9_VIA10(GND) U6.EPAD9_VIA11(GND) U6.EPAD9_VIA12(GND) U6.EPAD9_VIA13(GND) U6.EPAD9_VIA14(GND) U6.EPAD9_VIA15(GND) U6.EPAD9_VIA16(GND) U6.EPAD9_VIA17(GND) U6.EPAD9_VIA18(GND) U6.EPAD9_VIA19(GND) U6.EPAD9_VIA20(GND) U6.EPAD9_VIA21(GND) U6.EPAD9_VIA22(GND) U7.8(GND) U7.21(GND) U7.59(GND) U7.EPAD9(GND) U7.EPAD9_VIA1(GND) U7.EPAD9_VIA2(GND) U7.EPAD9_VIA3(GND) U7.EPAD9_VIA4(GND) U7.EPAD9_VIA5(GND) U7.EPAD9_VIA6(GND) U7.EPAD9_VIA7(GND) U7.EPAD9_VIA8(GND) U7.EPAD9_VIA9(GND) U7.EPAD9_VIA10(GND) U7.EPAD9_VIA11(GND) U7.EPAD9_VIA12(GND) U7.EPAD9_VIA13(GND) U7.EPAD9_VIA14(GND) U7.EPAD9_VIA15(GND) U7.EPAD9_VIA16(GND) U7.EPAD9_VIA17(GND) U7.EPAD9_VIA18(GND) U7.EPAD9_VIA19(GND) U7.EPAD9_VIA20(GND) U7.EPAD9_VIA21(GND) U7.EPAD9_VIA22(GND) U8.8(GND) U8.21(GND) U8.59(GND) U8.EPAD9(GND) U8.EPAD9_VIA1(GND) U8.EPAD9_VIA2(GND) U8.EPAD9_VIA3(GND) U8.EPAD9_VIA4(GND) U8.EPAD9_VIA5(GND) U8.EPAD9_VIA6(GND) U8.EPAD9_VIA7(GND) U8.EPAD9_VIA8(GND) U8.EPAD9_VIA9(GND) U8.EPAD9_VIA10(GND) U8.EPAD9_VIA11(GND) U8.EPAD9_VIA12(GND) U8.EPAD9_VIA13(GND) U8.EPAD9_VIA14(GND) U8.EPAD9_VIA15(GND) U8.EPAD9_VIA16(GND) U8.EPAD9_VIA17(GND) U8.EPAD9_VIA18(GND) U8.EPAD9_VIA19(GND) U8.EPAD9_VIA20(GND) U8.EPAD9_VIA21(GND) U8.EPAD9_VIA22(GND) ; also sheet 1,2
LIMIT1: C17.2 R7.2 U5.54(ADCIN)
LIMIT2: C18.2 R8.2 U6.54(ADCIN)
LIMIT3: C19.2 R9.2 U7.54(ADCIN)
LIMIT4: C20.2 R10.2 U8.54(ADCIN)
N$1: TP14.1 U8.64(OSCOUT)
N$14: CN1.2 R7.1 R31.1
N$16: CN2.2 R8.1 R32.1
N$18: BUSY1.+ RN4.8
N$20: CN5.2 R17.1
N$25: C39.2 R17.2 U5.18(SW)
N$26: C40.2 R18.2 U6.18(SW)
N$27: CN6.2 R18.1
N$28: C69.2 R23.2 U7.18(SW)
N$29: CN9.2 R23.1
N$30: FLAG1.+ RN4.7
N$31: C70.2 R24.2 U8.18(SW)
N$32: C41.2 D3.3(COM)
N$33: C41.1 U5.57(CP)
N$34: CN10.2 R24.1
N$35: CN3.2 R9.1 R33.1
N$36: BUSY2.+ RN4.6
N$37: FLAG2.+ RN4.5
N$39: FLAG1.- U5.16(!FLAG)
N$41: BUSY1.- U5.15(!BUSY!/SYNC)
N$42: R20.1 U5.9(SENSEB_S) U5.77(SENSEB_P) U5.82(SENSEB_P)
N$43: R19.1 U5.20(SENSEA_S) U5.34(SENSEA_P) U5.39(SENSEA_P)
N$44: CN4.2 R10.1 R34.1
N$46: CN7.1 J3.1 U5.38(OUTA1) U5.42(OUTA1) U5.53(OUTA1) U5.EPAD4(OUTA1) U5.EPAD4_VIA1(OUTA1) U5.EPAD4_VIA2(OUTA1) U5.EPAD4_VIA3(OUTA1) U5.EPAD4_VIA4(OUTA1) U5.EPAD4_VIA5(OUTA1) U5.EPAD4_VIA6(OUTA1) U5.EPAD4_VIA7(OUTA1) U5.EPAD4_VIA8(OUTA1)
N$47: CN7.2 J3.2 U5.22(OUTA2) U5.33(OUTA2) U5.37(OUTA2) U5.EPAD3(OUTA2) U5.EPAD3_VIA1(OUTA2) U5.EPAD3_VIA2(OUTA2) U5.EPAD3_VIA3(OUTA2) U5.EPAD3_VIA4(OUTA2) U5.EPAD3_VIA5(OUTA2) U5.EPAD3_VIA6(OUTA2) U5.EPAD3_VIA7(OUTA2) U5.EPAD3_VIA8(OUTA2)
N$48: TP7.1 U5.14(SDO) U6.12(SDI)
N$51: CN7.3 J3.3 U5.7(OUTB2) U5.81(OUTB2) U5.85(OUTB2) U5.EPAD8(OUTB2) U5.EPAD8_VIA1(OUTB2) U5.EPAD8_VIA2(OUTB2) U5.EPAD8_VIA3(OUTB2) U5.EPAD8_VIA4(OUTB2) U5.EPAD8_VIA5(OUTB2) U5.EPAD8_VIA6(OUTB2) U5.EPAD8_VIA7(OUTB2) U5.EPAD8_VIA8(OUTB2)
N$52: CN7.4 J3.4 U5.65(OUTB1) U5.76(OUTB1) U5.80(OUTB1) U5.EPAD7(OUTB1) U5.EPAD7_VIA1(OUTB1) U5.EPAD7_VIA2(OUTB1) U5.EPAD7_VIA3(OUTB1) U5.EPAD7_VIA4(OUTB1) U5.EPAD7_VIA5(OUTB1) U5.EPAD7_VIA6(OUTB1) U5.EPAD7_VIA7(OUTB1) U5.EPAD7_VIA8(OUTB1)
N$53: C42.2 D4.3(COM)
N$54: C42.1 U6.57(CP)
N$56: BUSY3.+ RN5.8
N$57: FLAG3.+ RN5.7
N$58: FLAG2.- U6.16(!FLAG)
N$59: BUSY2.- U6.15(!BUSY!/SYNC)
N$61: R22.1 U6.9(SENSEB_S) U6.77(SENSEB_P) U6.82(SENSEB_P)
N$62: R21.1 U6.20(SENSEA_S) U6.34(SENSEA_P) U6.39(SENSEA_P)
N$64: TP12.1 U6.64(OSCOUT) U7.63(OSCIN)
N$65: CN8.1 J4.1 U6.38(OUTA1) U6.42(OUTA1) U6.53(OUTA1) U6.EPAD4(OUTA1) U6.EPAD4_VIA1(OUTA1) U6.EPAD4_VIA2(OUTA1) U6.EPAD4_VIA3(OUTA1) U6.EPAD4_VIA4(OUTA1) U6.EPAD4_VIA5(OUTA1) U6.EPAD4_VIA6(OUTA1) U6.EPAD4_VIA7(OUTA1) U6.EPAD4_VIA8(OUTA1)
N$66: CN8.2 J4.2 U6.22(OUTA2) U6.33(OUTA2) U6.37(OUTA2) U6.EPAD3(OUTA2) U6.EPAD3_VIA1(OUTA2) U6.EPAD3_VIA2(OUTA2) U6.EPAD3_VIA3(OUTA2) U6.EPAD3_VIA4(OUTA2) U6.EPAD3_VIA5(OUTA2) U6.EPAD3_VIA6(OUTA2) U6.EPAD3_VIA7(OUTA2) U6.EPAD3_VIA8(OUTA2)
N$67: CN8.3 J4.3 U6.7(OUTB2) U6.81(OUTB2) U6.85(OUTB2) U6.EPAD8(OUTB2) U6.EPAD8_VIA1(OUTB2) U6.EPAD8_VIA2(OUTB2) U6.EPAD8_VIA3(OUTB2) U6.EPAD8_VIA4(OUTB2) U6.EPAD8_VIA5(OUTB2) U6.EPAD8_VIA6(OUTB2) U6.EPAD8_VIA7(OUTB2) U6.EPAD8_VIA8(OUTB2)
N$68: CN8.4 J4.4 U6.65(OUTB1) U6.76(OUTB1) U6.80(OUTB1) U6.EPAD7(OUTB1) U6.EPAD7_VIA1(OUTB1) U6.EPAD7_VIA2(OUTB1) U6.EPAD7_VIA3(OUTB1) U6.EPAD7_VIA4(OUTB1) U6.EPAD7_VIA5(OUTB1) U6.EPAD7_VIA6(OUTB1) U6.EPAD7_VIA7(OUTB1) U6.EPAD7_VIA8(OUTB1)
N$70: BUSY4.+ RN5.6
N$71: C82.1 D5.2(C2) U7.56(VBOOT)
N$72: C71.2 D5.3(COM)
N$73: C71.1 U7.57(CP)
N$75: FLAG4.+ RN5.5
N$76: CN11.4 J5.4 U7.65(OUTB1) U7.76(OUTB1) U7.80(OUTB1) U7.EPAD7(OUTB1) U7.EPAD7_VIA1(OUTB1) U7.EPAD7_VIA2(OUTB1) U7.EPAD7_VIA3(OUTB1) U7.EPAD7_VIA4(OUTB1) U7.EPAD7_VIA5(OUTB1) U7.EPAD7_VIA6(OUTB1) U7.EPAD7_VIA7(OUTB1) U7.EPAD7_VIA8(OUTB1)
N$77: FLAG3.- U7.16(!FLAG)
N$78: BUSY3.- U7.15(!BUSY!/SYNC)
N$80: R26.1 U7.9(SENSEB_S) U7.77(SENSEB_P) U7.82(SENSEB_P)
N$81: R25.1 U7.20(SENSEA_S) U7.34(SENSEA_P) U7.39(SENSEA_P)
N$83: TP8.1 U6.14(SDO) U7.12(SDI)
N$84: CN11.1 J5.1 U7.38(OUTA1) U7.42(OUTA1) U7.53(OUTA1) U7.EPAD4(OUTA1) U7.EPAD4_VIA1(OUTA1) U7.EPAD4_VIA2(OUTA1) U7.EPAD4_VIA3(OUTA1) U7.EPAD4_VIA4(OUTA1) U7.EPAD4_VIA5(OUTA1) U7.EPAD4_VIA6(OUTA1) U7.EPAD4_VIA7(OUTA1) U7.EPAD4_VIA8(OUTA1)
N$85: CN11.2 J5.2 U7.22(OUTA2) U7.33(OUTA2) U7.37(OUTA2) U7.EPAD3(OUTA2) U7.EPAD3_VIA1(OUTA2) U7.EPAD3_VIA2(OUTA2) U7.EPAD3_VIA3(OUTA2) U7.EPAD3_VIA4(OUTA2) U7.EPAD3_VIA5(OUTA2) U7.EPAD3_VIA6(OUTA2) U7.EPAD3_VIA7(OUTA2) U7.EPAD3_VIA8(OUTA2)
N$86: CN11.3 J5.3 U7.7(OUTB2) U7.81(OUTB2) U7.85(OUTB2) U7.EPAD8(OUTB2) U7.EPAD8_VIA1(OUTB2) U7.EPAD8_VIA2(OUTB2) U7.EPAD8_VIA3(OUTB2) U7.EPAD8_VIA4(OUTB2) U7.EPAD8_VIA5(OUTB2) U7.EPAD8_VIA6(OUTB2) U7.EPAD8_VIA7(OUTB2) U7.EPAD8_VIA8(OUTB2)
N$87: CN12.4 J6.4 U8.65(OUTB1) U8.76(OUTB1) U8.80(OUTB1) U8.EPAD7(OUTB1) U8.EPAD7_VIA1(OUTB1) U8.EPAD7_VIA2(OUTB1) U8.EPAD7_VIA3(OUTB1) U8.EPAD7_VIA4(OUTB1) U8.EPAD7_VIA5(OUTB1) U8.EPAD7_VIA6(OUTB1) U8.EPAD7_VIA7(OUTB1) U8.EPAD7_VIA8(OUTB1)
N$89: CN12.3 J6.3 U8.7(OUTB2) U8.81(OUTB2) U8.85(OUTB2) U8.EPAD8(OUTB2) U8.EPAD8_VIA1(OUTB2) U8.EPAD8_VIA2(OUTB2) U8.EPAD8_VIA3(OUTB2) U8.EPAD8_VIA4(OUTB2) U8.EPAD8_VIA5(OUTB2) U8.EPAD8_VIA6(OUTB2) U8.EPAD8_VIA7(OUTB2) U8.EPAD8_VIA8(OUTB2)
N$90: C84.1 D6.2(C2) U8.56(VBOOT)
N$91: C72.2 D6.3(COM)
N$92: C72.1 U8.57(CP)
N$96: FLAG4.- U8.16(!FLAG)
N$97: BUSY4.- U8.15(!BUSY!/SYNC)
N$99: R28.1 U8.9(SENSEB_S) U8.77(SENSEB_P) U8.82(SENSEB_P)
N$100: R27.1 U8.20(SENSEA_S) U8.34(SENSEA_P) U8.39(SENSEA_P)
N$103: CN12.1 J6.1 U8.38(OUTA1) U8.42(OUTA1) U8.53(OUTA1) U8.EPAD4(OUTA1) U8.EPAD4_VIA1(OUTA1) U8.EPAD4_VIA2(OUTA1) U8.EPAD4_VIA3(OUTA1) U8.EPAD4_VIA4(OUTA1) U8.EPAD4_VIA5(OUTA1) U8.EPAD4_VIA6(OUTA1) U8.EPAD4_VIA7(OUTA1) U8.EPAD4_VIA8(OUTA1)
N$104: CN12.2 J6.2 U8.22(OUTA2) U8.33(OUTA2) U8.37(OUTA2) U8.EPAD3(OUTA2) U8.EPAD3_VIA1(OUTA2) U8.EPAD3_VIA2(OUTA2) U8.EPAD3_VIA3(OUTA2) U8.EPAD3_VIA4(OUTA2) U8.EPAD3_VIA5(OUTA2) U8.EPAD3_VIA6(OUTA2) U8.EPAD3_VIA7(OUTA2) U8.EPAD3_VIA8(OUTA2)
N$108: Q3.3(OUT) TP10.1 U5.63(OSCIN)
N$109: TP11.1 U5.64(OSCOUT) U6.63(OSCIN)
N$110: TP13.1 U7.64(OSCOUT) U8.63(OSCIN)
N$111: TP9.1 U7.14(SDO) U8.12(SDI)
POWERSTEP_CS: U5.10(!CS) U6.10(!CS) U7.10(!CS) U8.10(!CS) ; also sheet 1
POWERSTEP_MISO: U8.14(SDO) ; also sheet 1
POWERSTEP_MOSI: U5.12(SDI) ; also sheet 1
POWERSTEP_RESET: U5.19(!STBY!/!RESET) U6.19(!STBY!/!RESET) U7.19(!STBY!/!RESET) U8.19(!STBY!/!RESET) ; also sheet 1
POWERSTEP_SCK: U5.11(CK) U6.11(CK) U7.11(CK) U8.11(CK) ; also sheet 1
VBOOT_1: C52.1 D3.2(C2) U5.56(VBOOT)
VBOOT_2: C54.1 D4.2(C2) U6.56(VBOOT)
VCC_1: C55.1 C61.2 U5.58(VCC) U5.60(VCCREG)
VCC_2: C56.1 C62.2 U6.58(VCC) U6.60(VCCREG)
VCC_3: C85.1 C91.2 U7.58(VCC) U7.60(VCCREG)
VCC_4: C86.1 C92.2 U8.58(VCC) U8.60(VCCREG)
VDDIO_1: C45.1 C65.2 C67.2 R31.2 RN4.1 RN4.2 U5.13(VDDIO) U5.62(VREG)
VDDIO_2: C46.1 C66.2 C68.2 R32.2 RN4.3 RN4.4 U6.13(VDDIO) U6.62(VREG)
VDDIO_3: C75.1 C95.2 C97.2 R33.2 RN5.1 RN5.2 U7.13(VDDIO) U7.62(VREG)
VDDIO_4: C76.1 C96.2 C98.2 R34.2 RN5.3 RN5.4 U8.13(VDDIO) U8.62(VREG)
VIN: C43.2 C44.2 C47.2 C48.2 C49.2 C50.2 C51.2 C52.2 C53.2 C54.2 C57.2 C58.2 C59.+ C60.+ C63.+ C64.+ C73.2 C74.2 C77.2 C78.2 C79.2 C80.2 C81.2 C82.2 C83.2 C84.2 C87.2 C88.2 C89.+ C90.+ C93.+ C94.+ D3.1(A1) D4.1(A1) D5.1(A1) D6.1(A1) U5.1(VS) U5.23(VS) U5.43(VS) U5.55(VS) U5.61(VSREG) U5.66(VS) U6.1(VS) U6.23(VS) U6.43(VS) U6.55(VS) U6.61(VSREG) U6.66(VS) U7.1(VS) U7.23(VS) U7.43(VS) U7.55(VS) U7.61(VSREG) U7.66(VS) U8.1(VS) U8.23(VS) U8.43(VS) U8.55(VS) U8.61(VSREG) U8.66(VS) ; also sheet 1
Unconnected: Q3.1(EN) U5.17(STCK) U6.17(STCK) U7.17(STCK) U8.17(STCK)

## Power pins joined to a net without a drawn wire
NC: IC1.12(NC)
RSVD1: IC1.38(RSVD1)
RSVD2: IC1.39(RSVD2)
RSVD3: IC1.40(RSVD3)

## Library data of the parts
3.3V BUSY1-BUSY4 = Seeed-LED:SMD-LED-CLEAR-GREEN(0603): 304090043; MPN: 19-217-G7C-AN1P2-3T
C1 C2 = OPL_Capacitor:CERAMIC-10UF-16V-(-20%～+80%)-Y5V(1210): 302010190
C3 C41 C42 C57 C58 C71 C72 C87 C88 = Seeed-Capacitor:CERAMIC-100NF-50V-10%-X7R(0805): 302010165; MPN: CC0805KRX7R9BB104; VALUE: 100nf
C4 C8 = Seeed-Capacitor:CERAMIC-100NF-50V-10%-X7R(0603): 302010138; MPN: CC0603KRX7R9BB104
C5 C9 C10 C13 C15 C16 C21-C24 C27 C28 C31 C38 C45 C46 C55 C56 C75 C76 C85 C86 = Seeed-Capacitor:CERAMIC-100NF-25V-10%-X7R(0402): 302010024; MPN: CC0402KRX7R8BB104
C6 C7 C32 C33 = Seeed-Capacitor:CERAMIC-15PF-50V-5%-NPO(0402): 302010041; MPN: GRM1555C1H150JA01D; VALUE: 15pf
C11 C12 C25 C26 = Seeed-Capacitor:CERAMIC-100UF-6.3V-20%-X5R(1206): 302010183; MPN: GRM31CR60J107ME39L; VALUE: 100uf
C14 = OPL_Capacitor:CERAMIC-10UF-10V-(-20%～+80%)-Y5V(0805): 302010158; MPN: CC0805ZKY5V6BB106; VALUE: 10uf
C17-C20 C39 C40 C69 C70 = OPL_Capacitor:CERAMIC-1UF-25V-10%-X7R(0603): 302010139; MPN: CC0603KRX7R8BB105
C29 = Seeed-Capacitor:CERAMIC-4.7UF-10V-10%-X5R(0603): 302010111; MPN: CC0603KRX5R6BB475; VALUE: 4.7uf
C30 C35 = Seeed-Capacitor:CERAMIC-10NF-50V-10%-X7R(0402): 302010006; MPN: CC0402KRX7R9BB103
C34 = Seeed-Capacitor:CERAMIC-22NF-50V-10%-X7R(0402): 302010242; MPN: CC0402KRX7R9BB223
C36 C37 = Seeed-Capacitor:CERAMIC-4.7NF-50V-10%-X7R(0402): 302010261; MPN: CC0402KRX7R9BB472; VALUE: 4.7NF 50V
C43 C44 C47-C51 C53 C73 C74 C77-C81 C83 = Seeed-Capacitor:CERAMIC-22UF-6.3V-20%-X5R(0805): 302010171; MPN: CC0805MKX5R5BB226; VALUE: 22uf
C52 C54 C82 C84 = Seeed-Capacitor:CERAMIC-100PF-50V-5%-NPO(0603): 302010076; MPN: CC0603JRNPO9BN101; VALUE: 100pf
C59 C60 C63 C64 C89 C90 C93 C94 = adafruit:CPOL-US: POLARIZED CAPACITOR, American symbol
C61 C62 C91 C92 = Seeed-Capacitor:CERAMIC-220NF-25V-10%-X7R(0603): 302010073; MPN: CC0603KRX7R8BB224; VALUE: 220nf
C65 C66 C95 C96 = Seeed-Capacitor:CERAMIC 100NF-10V-10%-X5R(0402): 302010037; MPN: CC0402KRX5R6BB104; VALUE: 100NF 10V
C67 C68 C97 C98 = Seeed-Capacitor:CERAMIC-22UF-6.3V-20%-X5R(0805): 302010171; MPN: CC0805MKX5R5BB226
CN1-CN6 CN9 CN10 = jst-xa:B3B-XASK-1: Wire-to-Board 2.5mm pitch top mount connector Source: http://www.jst-mfg.com/product/pdf/jpn/XA1.pdf http://www.jst-mfg.com/product/detail.php?series=272
CN7 CN8 CN11 CN12 = jst-xa:B4B-XASK-1: Wire-to-Board 2.5mm pitch top mount connector Source: http://www.jst-mfg.com/product/pdf/jpn/XA1.pdf http://www.jst-mfg.com/product/detail.php?series=272
D1 = SparkFun-DiscreteSemi:DIODE-ZENER: Zener Diode A Zener diode allows current to flow from its anode to its cathode like a normal semiconductor diode, but it also permits current to flow in the reverse direction when its "Zener voltage" is reached. - WIkipedia; PROD_ID: DIO-11284; VALUE: 3.3V
D2 = OPL_Discrete_Semiconductor:SMD-DIODE-SCHOTTKY-40V-1A(DO-214AC): 304020027; MPN: 1N5819; VALUE: 40V-1A
D3-D6 = SparkFun-DiscreteSemi:BAV99: Series-pair diode array Two small signal silicon diodes connected anode to cathode. Connections to all three nodes available. Link to datasheet <https://www.fairchildsemi.com/datasheets/BA/BAV99.pdf> SparkFun Products: SparkFun AutoDriver <https://www.sparkfun.com/products/13752>; PROD_ID: DIO-10647; VALUE: 200mA/70V
FLAG1-FLAG4 TX = Seeed-LED:SMD-LED-CLEAR-YELLOW(0603): 304090044; MPN: 19-217-Y5C-AM1N1VY-3T
IC1 = _kantaParts:0982_W5500: The W5500 chip is a Hardwired TCP/IP embedded Ethernet controller that enables easier internet connection for embedded systems using SPI (Serial Peripheral Interface). Case TQFP48
ID = switch-dil:219-08*: Surface Mount DIP Switch Series 219 SMT CTS Electronic Components Sourc: www.ctscorp.com; OC_FARNELL: unknown; OC_NEWARK: unknown
J1 = PonoorExperiments:POWERJACK
J2 = PonoorExperiments:SDCARD_SLOT: SD/microSD card slot
J3-J6 = 691321300004:691321300004: WR-TBL Serie 321 - 3.81mm Vertical PCB Header , 4 Pins=>Code : Con_TBL_Pluggable_3.81_PCB_THT_Simple_691321300004 <http://katalog.we-online.de/media/images/eican/Con_TBL_Pluggable_3.81_PCB_THT_Simple_6913213000xx_pf2.jpg> Details see: http://katalog.we-online.de/en/em/TBL_3_81_321_VERTICAL_PCB_HEADER_6913213000XX Created 2014-06-19, Karrer Zheng 2014 (C) Würth Elektronik; AVAILABILITY: Unavailable; DESCRIPTION: 321; 3.81mm Pitch Straight Pluggable Term Block, PCB Header, Through Hole, 4 Way; MF: Wurth Electronics; MP: 691321300004; PACKAGE: None; PRICE: None
J7 = Wurth_Connectors_WR-BHD:6120XX21621_61200621621: WR-BHD 2.54 mm Male Box Header KIND PROPERTIES: Pitch 2.54 mm Gender:Male MATERIAL PROPERTIES: Insulator Material:PBT Insulator Flammability Rating UL94 V-0 Insulator Color:Black Contact Material :Copper Alloy Contact Plating :Gold Contact Type: Stamped GENERAL INFORMATION: Operating Temperature:-40 °C up to +125 °C Compliance:RoHS Working Voltage: 250 V (AC) Withstanding Voltage:500 V (AC) Contact Resistance: 20 mΩ Insulation Resistance:1000 MΩ CERTIFICATION: UL Approval:E323964 PACKAGING PROPERTIES Packaging :Tray <https://katalog.we-online.com/media/images/v2/o32884v209%20Family_WR-BHD_6120xx21621.jpg> Details see: https://katalog.we-online.com/en/em/BHD_2_54_MALE_BOX_HEADER_6120XX21621 Updated by Yingchun,Shan 2019-10-29 2019 (C) Würth Elektronik; CONTACT-RESISTANCE: 20mOhm; DATASHEET-URL: https://katalog.we-online.com/em/datasheet/61200621621.pdf; GENDER: Male; IR: 3A; L: 15.28mm; MATES: WR-BHD 2.54mm Female IDC Connector with Strain Relief; MOUNT: THT; PACKAGING: Tray; PART-NUMBER: 61200621621; PINS: 6; PITCH: 2.54mm; TOL-R: max.; TYPE: Straight; WORKING-VOLTAGE: 250V(AC)
J8 = PonoorExperiments:CONN_06
L = Seeed-LED:SMD-LED-CLEAR-BLUE(0603): 304090045; MPN: 19-217-BHC-ZL1M2RY-3T
L1 = _kantaParts:L: L 5045 : TDK VLS5045EX, Bourns SRN5040 2012 : Bourns MH2029-300Y <http://www.mouser.jp/ProductDetail/Bourns/MH2029-300Y/>
L2 L3 = Seeed-Inductor:SMD-FERRITE-BEAD-330R-1500MA(0805): 303030006; MPN: BLM21PG331SN1D
Q1 = transistor-power:IRF?5305: HEXFET Power MOSFET Source: http://www.irf.com/product-info/datasheets/data/irfr5305pbf.pdf
Q2 = _kantaParts:CRYSTAL: CRYSTAL
Q3 = _kantaParts:CRYSTAL_OSC
R1-R3 R5 R6 = Seeed-Resistor:SMD-RES-100K-1%-1/10W(0603): 301010196; MPN: RC0603FR-07100KL; VALUE: 100K
R4 R12 = Seeed-Resistor:SMD-RES-10K-5%-1/10W(0603): 301010293; MPN: RC0603JR-0710KL
R7-R10 R17 R18 R23 R24 = Seeed-Resistor:SMD-RES-100R-5%-1/10W(0603): 301010090; MPN: RC0603JR-07100RL
R11 = Seeed-Resistor:SMD-RES-12K-1%-1/10W(0603): 301010102; MPN: RC0603FR-0712KL; VALUE: 12K
R13 = Seeed-Resistor:SMD-RES-1M-5%-1/10W(0603): 301010100; MPN: RC0603JR-071ML
R14 = Seeed-Resistor:SMD-RES-10R-5%-1/10W(0603): 301010096; MPN: RC0603JR-0710RL
R15 R16 = Seeed-Resistor:SMD-RES-330R-1%-1/10W(0603): 301010300; MPN: RC0603FR-07330RL
R19-R22 R25-R28 = _kantaParts:RESISTOR: Resistors TAKMAN RWBS/RSBS series http://www.takman-e.co.jp/pdf/rwb_rsb.pdf
R29 R30 = OPL_Resistor:SMD-RES-5.1K-1%-1/10W(0603): 301012088; MPN: RC0603FR-071K5L; VALUE: 1.5K
R31-R34 = OPL_Resistor:SMD-RES-10K-5%-1/10W(0603): 301010293; MPN: RC0603JR-0710KL
R35 R36 = OPL_Resistor:SMD-RES-4.7K-5%-1/10W(0603): 301010290; MPN: RC0603JR-074K7L
RESET = PonoorExperiments:SWITCH-SPST-2
RN1-RN5 = _kantaParts:4R-N: Array Chip Resistor Source: RS Component / Phycomp
RX = Seeed-LED:LED-SMD-RED-DIFFUSED(0603): 304090042; MPN: 19-217-R6C-AL1M2VY-3T
S2-S6 = SparkFun-Electromechanical:STANDOFF_ELECTRICAL: A standoff intended to be an electrically connected point. Pad size and stop size allow for a #4 Phillips pan screw head to make a solid connection to the board.
SWD = PonoorExperiments:CORTEX_DEBUG
TP1-TP19 = PonoorExperiments:TESTPOINT
U1 = _kantaParts:USBLC6: STMicroelectronics USBLC6 VERY LOW CAPACITANCE ESD PROTECTION RS 624-7693 <http://jp.rs-online.com/web/p/tvs/6247693/>
U2 = _kantaParts:BD9G341AEFJ
U3 = SparkFun-IC-Power:V_REG_LM1117: Voltage Regulator LM1117 Standard adjustable voltage regulator but in SMD form. Spark Fun Electronics SKU : COM-00595; PROD_ID: VREG-08170
U4 = samd21-temp:ATSAMD21G: Atmel SAMD21G SMART ARM-Based Microcontroller The Atmel ® | SMART ™ SAM D21 is a series of low-power microcontrollers using the 32-bit ARM ® Cortex ® -M0+ processor, and ranging from 32- to 64-pins with up to 256KB Flash and 32KB of SRAM. The SAM D21 devices operate at a maximum frequency of 48MHz and reach 2.46 CoreMark/MHz. They are designed for simple and intuitive migration with identical peripheral modules, hex compatible code, identical linear address map and pin compatible migration paths between all devices in the product series. All devices include intelligent and flexible peripherals, Atmel Event System for inter-peripheral signaling, and support for capacitive touch button, slider and wheel user interfaces.; PROD_ID: IC-13064
U5-U8 = _kantaParts:POWERSTEP01: powerSTEP01 Series 5V 10A System-in-Package Integrating Microstepping Controller
USB1 = USB-C-U262-161N-4BVC11:USB-C_USB2.0-TYPE-C
X1 = PonoorExperiments:CONN_02
X2 = SmartPrj:CRYSTAL-3.2-2.5
X3 = _kantaParts:RJ45_MAGNETICS_LED